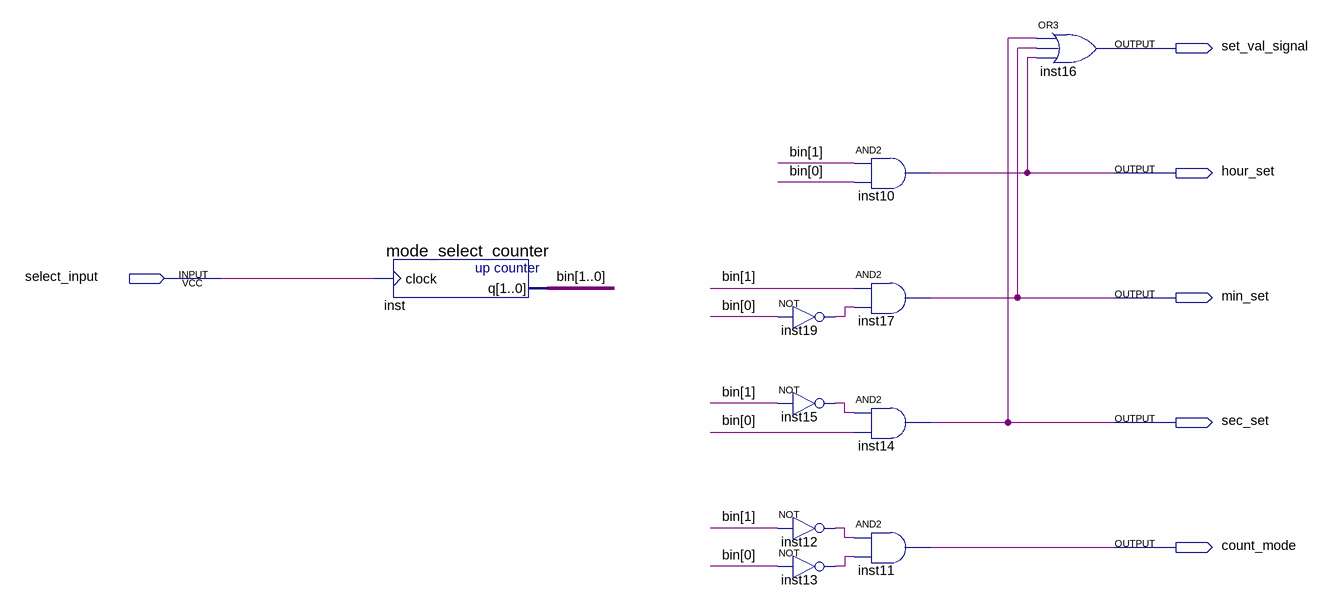
[diagram p0: schematic sheet]
// Quartus schematic mode_selector.bdf as structural Verilog: 10 symbols, 6 pins
module mode_selector (
  input  select_input,
  output set_val_signal,
  output hour_set,
  output min_set,
  output sec_set,
  output count_mode
);

  wire inst12_out, inst13_out, inst15_out, inst19_out;
  wire [1:0] bin;

  mode_select_counter inst (.clock(select_input), .q(bin));
  not inst19 (inst19_out, bin[0]);
  not inst15 (inst15_out, bin[1]);
  not inst12 (inst12_out, bin[1]);
  not inst13 (inst13_out, bin[0]);
  and inst10 (hour_set, bin[1], bin[0]);
  and inst17 (min_set, bin[1], inst19_out);
  and inst14 (sec_set, inst15_out, bin[0]);
  and inst11 (count_mode, inst12_out, inst13_out);
  or inst16 (set_val_signal, sec_set, min_set, hour_set);
endmodule
